# Altium schematic sheet 2_Topology.SchDoc: OBDH Topology
size A3; DrawnBy: Sara V.Martinez; Engineer: Flight; Revision: V0.0; SheetNumber: 2; SheetTotal: 7
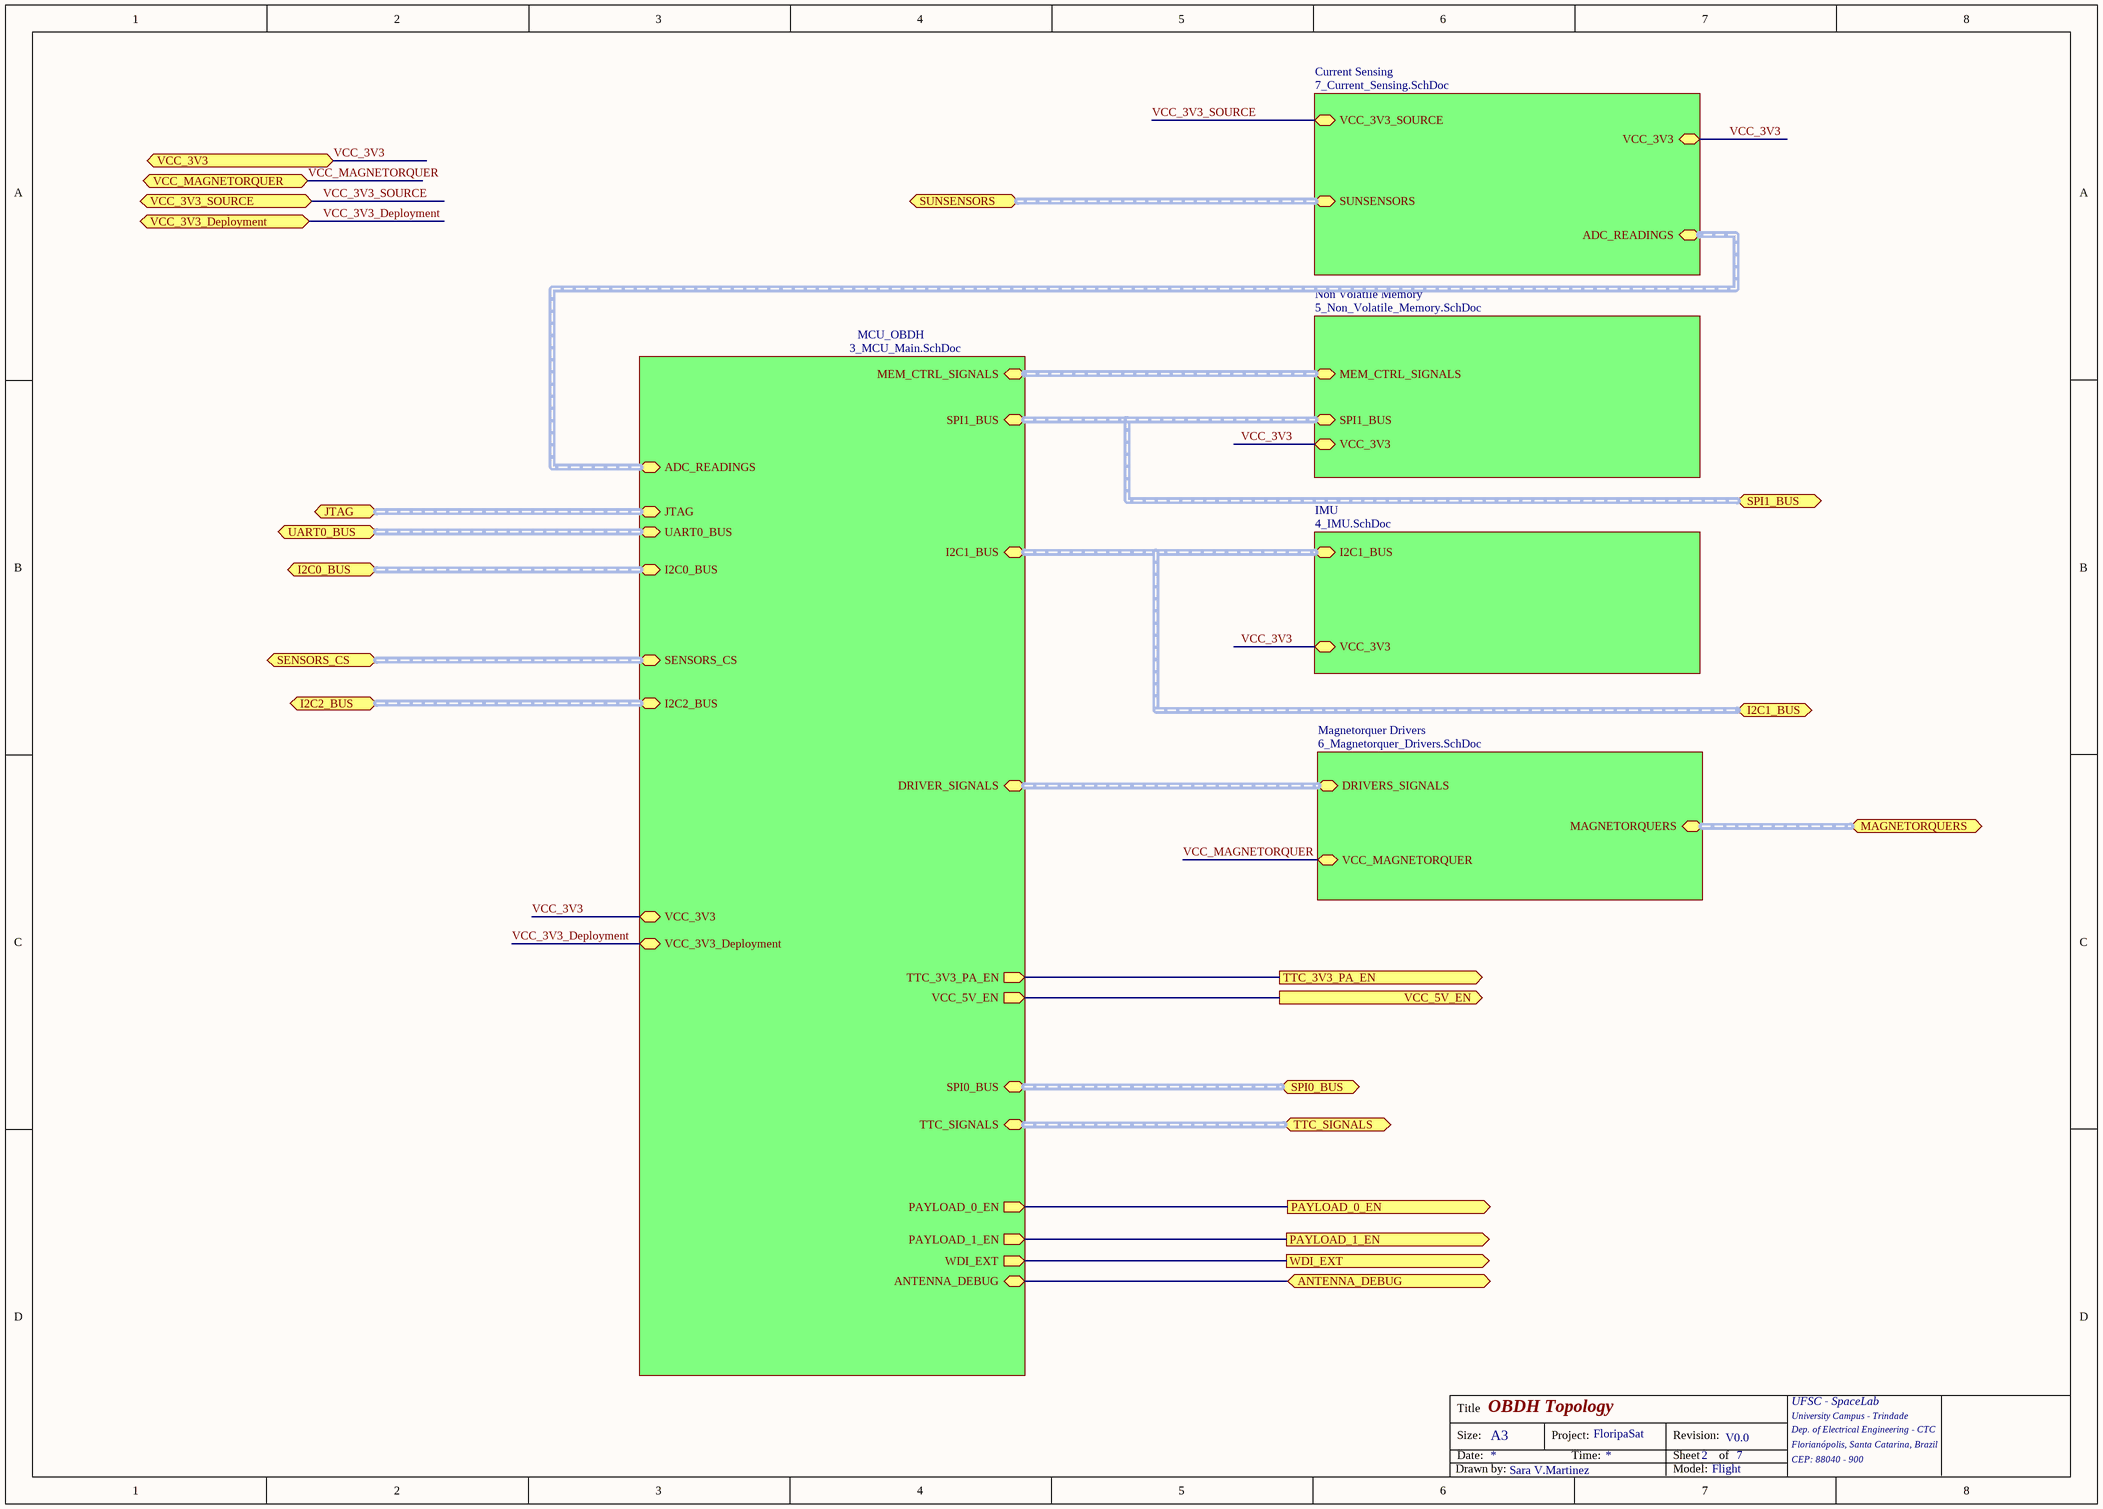
[diagram p0: 2_Topology.SchDoc]

## Sub-sheets
Current Sensing = 7_Current_Sensing.SchDoc: VCC_3V3, SUNSENSORS (harness SUNSENSORS), ADC_READINGS (harness ADC_READINGS), VCC_3V3_SOURCE
IMU = 4_IMU.SchDoc: I2C1_BUS (harness I2C1_BUS), VCC_3V3
Magnetorquer Drivers = 6_Magnetorquer_Drivers.SchDoc: MAGNETORQUERS (harness MAGNETORQUERS), DRIVERS_SIGNALS (harness DRIVER_SIGNALS), VCC_MAGNETORQUER
MCU_OBDH = 3_MCU_Main.SchDoc: JTAG (harness JTAG), UART0_BUS (harness UART0_BUS), VCC_3V3, TTC_3V3_PA_EN (out), SENSORS_CS (harness SENSORS_CS), PAYLOAD_0_EN (out), VCC_5V_EN (out), DRIVER_SIGNALS (harness DRIVER_SIGNALS), I2C1_BUS (harness I2C1_BUS), SPI1_BUS (harness SPI1_BUS), TTC_SIGNALS (harness TTC_SIGNALS), ADC_READINGS (harness ADC_READINGS), PAYLOAD_1_EN (out), MEM_CTRL_SIGNALS (harness MEM_CTRL_SIGNALS), WDI_EXT (out), I2C2_BUS (harness I2C2_BUS), SPI0_BUS (harness SPI0_BUS), I2C0_BUS (harness I2C0_BUS), ANTENNA_DEBUG, VCC_3V3_Deployment
Non Volatile Memory = 5_Non_Volatile_Memory.SchDoc: SPI1_BUS (harness SPI1_BUS), VCC_3V3, MEM_CTRL_SIGNALS (harness MEM_CTRL_SIGNALS)

## Ports
ANTENNA_DEBUG, I2C0_BUS (harness I2C0_BUS), I2C1_BUS (harness I2C1_BUS), I2C2_BUS (harness I2C2_BUS), JTAG (harness JTAG), MAGNETORQUERS (harness MAGNETORQUERS), PAYLOAD_0_EN (out), PAYLOAD_1_EN (out), SENSORS_CS (harness SENSORS_CS), SPI0_BUS (harness SPI0_BUS), SPI1_BUS (harness SPI1_BUS), SUNSENSORS (harness SUNSENSORS), TTC_3V3_PA_EN (out), TTC_SIGNALS (harness TTC_SIGNALS), UART0_BUS (harness UART0_BUS), VCC_3V3, VCC_3V3_Deployment, VCC_3V3_SOURCE, VCC_5V_EN (out), VCC_MAGNETORQUER, WDI_EXT (out)

## Nets
ANTENNA_DEBUG: port ANTENNA_DEBUG, sheet MCU_OBDH/ANTENNA_DEBUG
PAYLOAD_0_EN: port PAYLOAD_0_EN, sheet MCU_OBDH/PAYLOAD_0_EN
PAYLOAD_1_EN: port PAYLOAD_1_EN, sheet MCU_OBDH/PAYLOAD_1_EN
TTC_3V3_PA_EN: port TTC_3V3_PA_EN, sheet MCU_OBDH/TTC_3V3_PA_EN
VCC_3V3: port VCC_3V3, sheet MCU_OBDH/VCC_3V3, sheet Current Sensing/VCC_3V3, sheet Non Volatile Memory/VCC_3V3, sheet IMU/VCC_3V3
VCC_3V3_Deployment: port VCC_3V3_Deployment, sheet MCU_OBDH/VCC_3V3_Deployment
VCC_3V3_SOURCE: port VCC_3V3_SOURCE, sheet Current Sensing/VCC_3V3_SOURCE
VCC_5V_EN: port VCC_5V_EN, sheet MCU_OBDH/VCC_5V_EN
VCC_MAGNETORQUER: port VCC_MAGNETORQUER, sheet Magnetorquer Drivers/VCC_MAGNETORQUER
WDI_EXT: port WDI_EXT, sheet MCU_OBDH/WDI_EXT

## Buses and harness runs
harness port I2C0_BUS = sheet MCU_OBDH/I2C0_BUS
harness port I2C1_BUS = sheet IMU/I2C1_BUS = sheet MCU_OBDH/I2C1_BUS
harness port I2C2_BUS = sheet MCU_OBDH/I2C2_BUS
harness port JTAG = sheet MCU_OBDH/JTAG
harness port MAGNETORQUERS = sheet Magnetorquer Drivers/MAGNETORQUERS
harness port SENSORS_CS = sheet MCU_OBDH/SENSORS_CS
harness port SPI0_BUS = sheet MCU_OBDH/SPI0_BUS
harness port SPI1_BUS = sheet MCU_OBDH/SPI1_BUS = sheet Non Volatile Memory/SPI1_BUS
harness port SUNSENSORS = sheet Current Sensing/SUNSENSORS
harness port TTC_SIGNALS = sheet MCU_OBDH/TTC_SIGNALS
harness port UART0_BUS = sheet MCU_OBDH/UART0_BUS
harness sheet Current Sensing/ADC_READINGS = sheet MCU_OBDH/ADC_READINGS
harness sheet Magnetorquer Drivers/DRIVERS_SIGNALS = sheet MCU_OBDH/DRIVER_SIGNALS
harness sheet MCU_OBDH/MEM_CTRL_SIGNALS = sheet Non Volatile Memory/MEM_CTRL_SIGNALS

## Notes on the sheet
- Title
- Size:
- Date:
- A3
- Project:
- Time:
- FloripaSat
- Revision:
- Sheet
- of
- UFSC - SpaceLab
- University Campus - Trindade
- Dep. of Electrical Engineering - CTC
- Florianópolis, Santa Catarina, Brazil
- CEP: 88040 - 900
- Drawn by:
- Model: